# Altium project OPA847放大器.PrjPcb
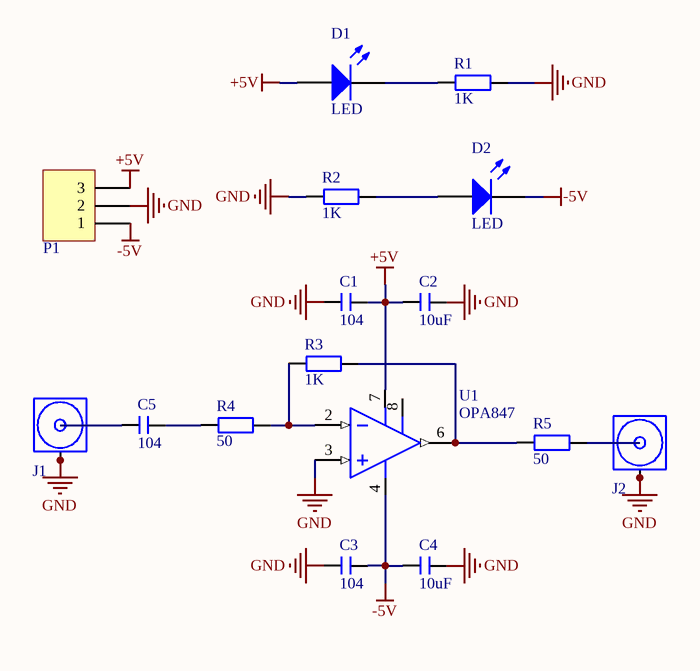
[diagram p0: OPA847.SchDoc]
1 sheet, 16 parts. Net scope: global (net labels, ports and power ports of the same name join across sheets).
Board file: OPA847.PcbDoc

## Sheet OPA847.SchDoc
size A4

### Parts
C1  104  [C 0805]
C2  10uF  [C 0805]
C3  104  [C 0805]
C4  10uF  [C 0805]
C5  104  [C 0603]
D1  LED  [LED_0805]
D2  LED  [LED_0805]
J1  COAX  [MCX5.08-5-H]  (value not drawn)
J2  COAX  [MCX5.08-5-H]  (value not drawn)
P1  Header 3  [HDR3X1_B2]  (value not drawn)
R1  1K  [R 0805]
R2  1K  [R 0805]
R3  1K  [R 0603]
R4  50  [R 0603]
R5  50  [R 0603]
U1  OPA847  [SO8_N]

### Nets
+5V: C1.2 C2.1 D1.1(A) P1.3 U1.7(V+)
-5V: C3.2 C4.1 D2.2(K) P1.1 U1.4(V-)
GND: C1.1 C2.2 C3.1 C4.2 J1.2(GND) J1.3(GND) J1.4(GND) J1.5(GND) J2.2(GND) J2.3(GND) J2.4(GND) J2.5(GND) P1.2 R1.2 R2.1 U1.3(IN+)
NetC5_1: C5.1 J1.1(Signal)
NetC5_2: C5.2 R4.1
NetD1_2: D1.2(K) R1.1
NetD2_1: D2.1(A) R2.2
NetJ2_1: J2.1(Signal) R5.2
NetR3_1: R3.1 R4.2 U1.2(IN-)
NetR3_2: R3.2 R5.1 U1.6(OUT)

Not connected (* = marked no-connect by the designer): U1 8

### Library data of the parts
C1-C5 = C: 无极性贴片电容; 版权归属: 源创客; BOM名称: 无极性贴片电容; 学习资源: www.ooocke.com
D1 D2 = LED: 发光二极管; Published: 8-Jun-2000; LatestRevisionDate: 08-Jul-2005; LatestRevisionNote: Mech Layer 1 removed.; PackageReference: LED; Publisher: Altium Limited
P1 = Header 3: 接插件; LatestRevisionDate: 17-Jul-2002; LatestRevisionNote: Re-released for DXP Platform.; Publisher: Altium Limited
R1-R5 = R: 贴片电阻; 版权归属: 源创客; BOM名称: 贴片电阻; 学习资源: www.ooocke.com
U1 = OPA847: Wideband, Ultra-Low Noise, Voltage-Feedback